# EAGLE design piezo-preamp-tickler_V0-7 (EAGLE 7.7.0)
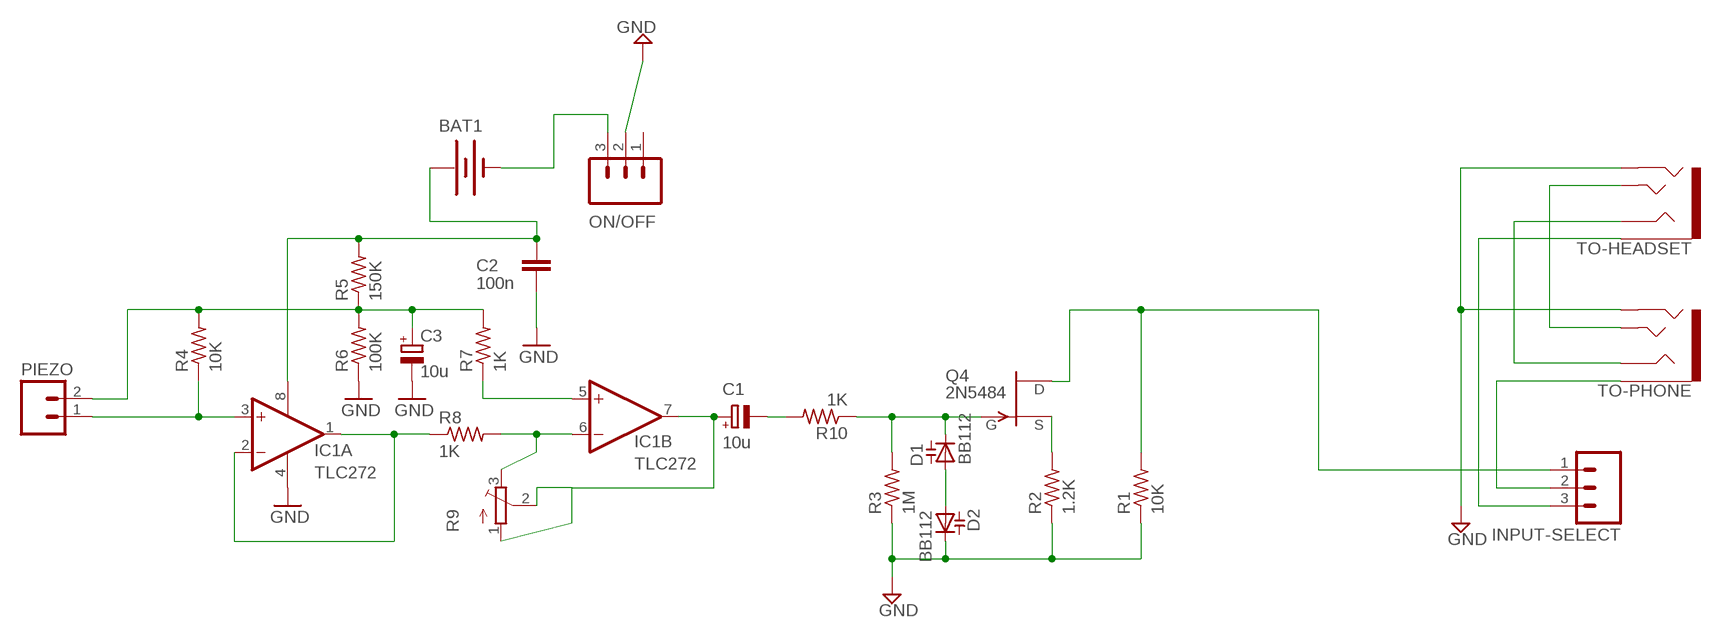
[diagram p0: schematic, sheet 1]

## Parts
BAT1  BATTERYA23  [BATTERY-A23]
C1  10u  CPOL-EUE2.5-5  [E2,5-5]
C2  100n  C-EU025-025X050  [C025-025X050]
C3  10u  CPOL-EUE2.5-5  [E2,5-5]
D1  BB112  [SOT54H]
D2  BB112  [SOT54H]
IC1  TLC272  TLC272P  [DIL08]
INPUT-SELECT  M03SINGLE-POLE-DOUBLE-THROW  [SPDT-SWITCH]
ON/OFF  labl  M03SINGLE-POLE-DOUBLE-THROW  [SPDT-SWITCH]
PIEZO  M02LOCK  [1X02_LOCK]
Q4  2N5484  [TO92-]
R1  10K  R-US_0204/2V  [0204V]
R2  1.2K  R-US_0204/2V  [0204V]
R3  1M  R-US_0204/2V  [0204V]
R4  10K  R-US_0204/2V  [0204V]
R5  150K  R-US_0204/2V  [0204V]
R6  100K  R-US_0204/2V  [0204V]
R7  1K  R-US_0204/2V  [0204V]
R8  1K  R-US_0204/2V  [0204V]
R9  TRIMPOT3386  [TRIM-3386]
R10  1K  R-US_0204/2V  [0204V]
TO-HEADSET  AUDIO-JACK3  [AUDIO-JACK-TRRS-SMD]
TO-PHONE  AUDIO-JACK3  [AUDIO-JACK-TRRS-SMD]

## Nets
`DEL: INPUT-SELECT.1 Q4.3(D) R1.2
GND: C2.1 C3.- D2.C IC1.4(P:V-) ON/OFF.2 R1.1 R2.1 R3.1 R6.1 TO-HEADSET.RING2 TO-PHONE.RING2
N$1: D1.A D2.A
N$2: BAT1.GND@1(-) ON/OFF.3
N$3: Q4.2(S) R2.2
N$5: IC1.5(B:+IN) R7.1
N$6: C1.+ IC1.7(B:OUT) R9.1(A) R9.2(S)
N$7: IC1.6(B:-IN) R8.2 R9.3(E)
N$8: C3.+ PIEZO.2 R4.2 R5.1 R6.2 R7.2
N$9: IC1.3(A:+IN) PIEZO.1 R4.1
N$10: D1.C Q4.1(G) R3.2 R10.1
N$11: C1.- R10.2
N$12: INPUT-SELECT.3 TO-HEADSET.EARTH
N$13: TO-HEADSET.TIP TO-PHONE.TIP
N$14: IC1.1(A:OUT) IC1.2(A:-IN) R8.1
N$15: TO-HEADSET.RING1 TO-PHONE.RING1
TO-PHONE: INPUT-SELECT.2 TO-PHONE.EARTH
V9V: BAT1.PWR@1(+) C2.2 IC1.8(P:V+) R5.2
Unconnected: ON/OFF.1

## Library data of the parts
BAT1 = Daniel:BATTERY: Battery Holders Various common sizes : AA, AAA, 18650 (PRT-12895), 20mm coin cell and 12mm coin cell. 20MM_4LEGS, BATT-10373
C1 C3 = rcl:CPOL-EU: POLARIZED CAPACITOR, European symbol
C2 = rcl:C-EU: CAPACITOR, European symbol
D1 D2 = diode:BB112: Capacity DIODE variable-capacitance diode
IC1 = linear:TLC272: OP AMP
INPUT-SELECT ON/OFF = Daniel:M03: Single Pole Double Throw Switch 2.0mm pitch 3-pin header for switch.
PIEZO = SparkFun-Connectors:M02: Header 2 Standard 2-pin 0.1" header. Use with straight break away headers (SKU : PRT-00116), right angle break away headers (PRT-00553), swiss pins (PRT-00743), machine pins (PRT-00117), and female headers (PRT-00115). Molex polarized connector foot print use with SKU : PRT-08233 with associated crimp pins and housings.
Q4 = transistor-fet:?548*: N-Channel JFETs Source: VISHAY 2N5484.pdf Compatible: TO92 2N5245 J304 J305 U310 J308 J309 J310 TO72 2N4416 2N4416A 2N3823 2N4351 3N169 3N170 3N171 MFE3002 TO18 2N3796 2N3797 MFE825 Source: Motorola European Master Guide Pacge 3-59
R1-R8 R10 = resistor:R-US_: RESISTOR, American symbol
R9 = adafruit:TRIMPOT: SMT trimmer potentiometer part number TC33X http://www.ladyada.net/library/eagle
TO-HEADSET TO-PHONE = SparkFun-Connectors:AUDIO-JACK3: Audio jack - 3.5mm TRRS variety - two rings.

## Net classes
0 default: width 0.152 mm, clearance 0.2 mm

## Board
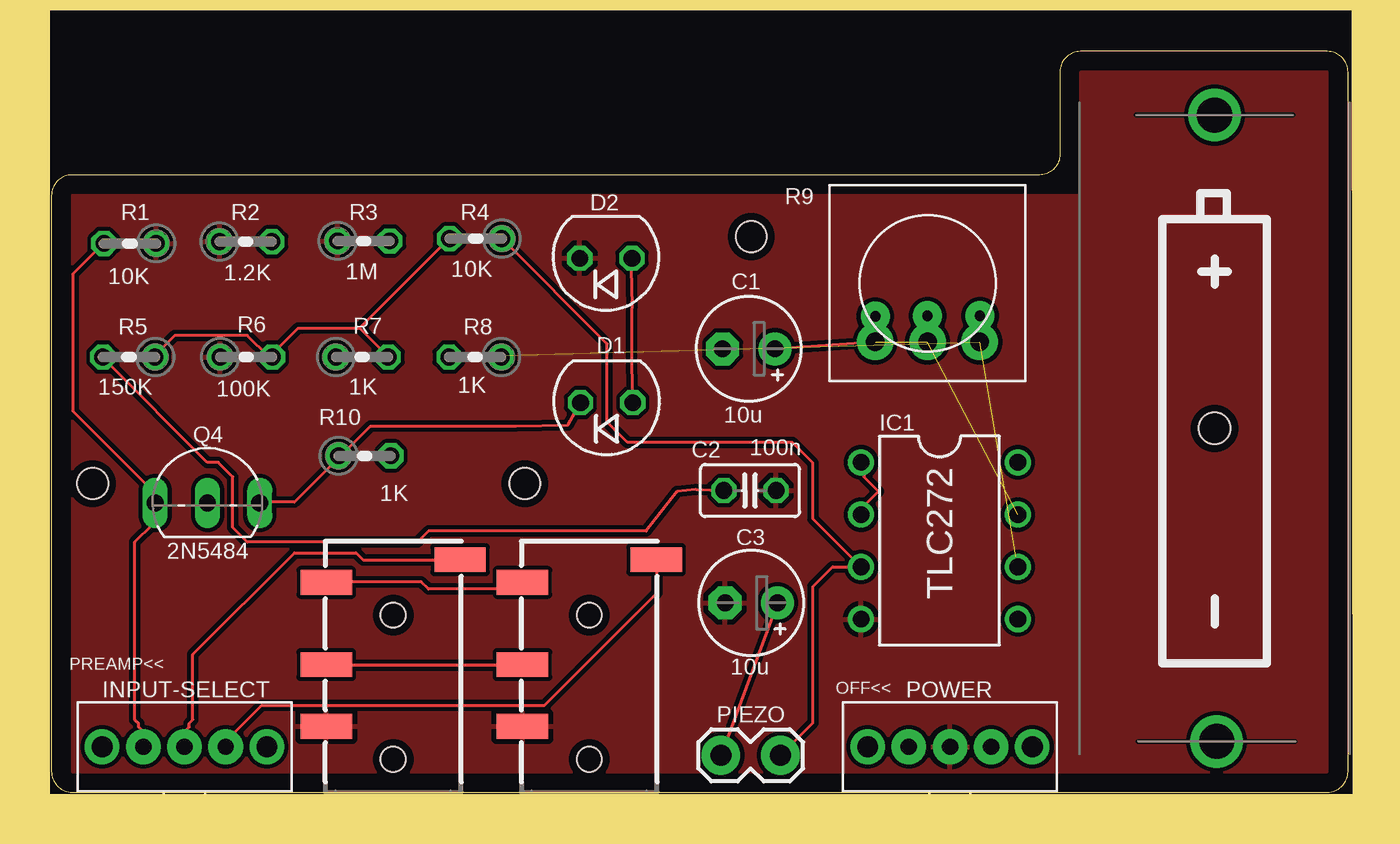
[diagram p1: board, top side]
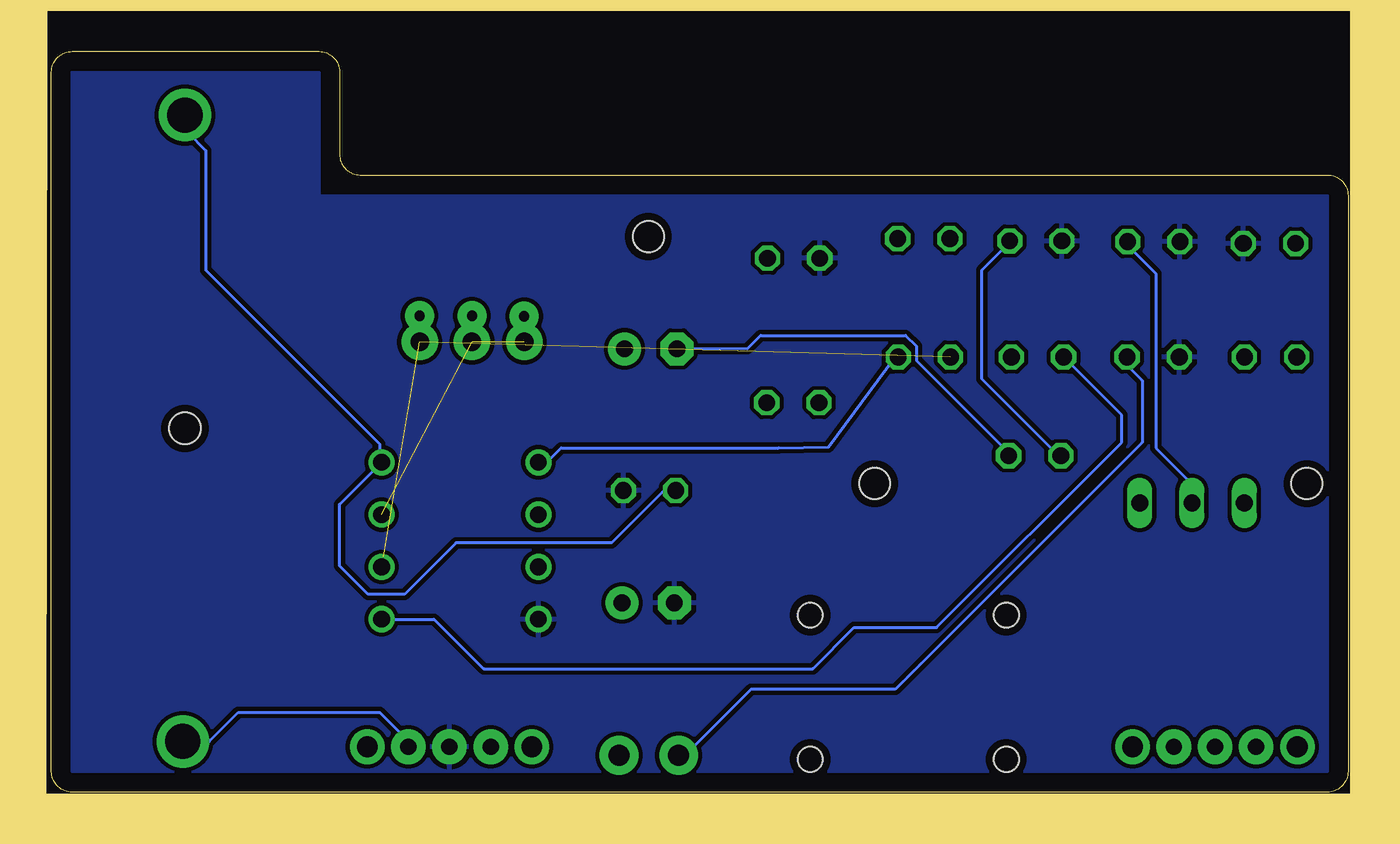
[diagram p2: board, bottom side, seen from below]

Size 63 x 36 mm. Coordinates in mm from the lower left corner, seen from the top.
Outline: 48,30 1,30 arc90 0,29 0,1 arc90 1,0 62,0 arc90 63,1 63,35 arc90 62,36 50,36 arc90 49,35 49,31 arc-90 48,30
Copper layers (1*16): Top 0.0356mm / dielectric 1.5011mm / Bottom 0.0356mm
Design rules "oshpark-2layer": minimum track width 6mil, minimum drill 13mil, track to track 6mil, track to pad 6mil, pad to pad 6mil, via to via 6mil, smd to smd 6mil, copper to edge 15mil, drill to drill 6mil, minimum pad ring 7mil, minimum via ring 7mil, stop-mask expansion 2.5mil, vias tented up to drill 0mil, thermal gap 10mil
Holes 1.5 mm at 34,27 2,15 23,15
Milling: 4 lines

### Footprints (pad centres in the part's own frame; a part is rotated, then mirrored left to right if it is on the bottom)
BATTERY-A23 = drill 1.702: GND@1 15.22,0.1; PWR@1 -15.22,0 | hole 1.524: 0,0
E2,5-5 = drill 0.813 pad 1.6: + -1.27,0 | drill 0.813 pad 1.6 octagon: - 1.27,0
C025-025X050 = drill 0.813 octagon: 1 -1.27,0; 2 1.27,0
SOT54H = drill 0.813 octagon: A 1.27,0; C -1.27,0
DIL08 = drill 0.813 pad 1.27: 1 -3.81,-3.81; 2 -1.27,-3.81; 3 1.27,-3.81; 4 3.81,-3.81; 5 3.81,3.81; 6 1.27,3.81; 7 -1.27,3.81; 8 -3.81,3.81
SPDT-SWITCH = drill 0.8 pad 1.676: 1 2,0; 2 4,0; 3 6,0 | drill 1 pad 1.676: P$1 0,0; P$2 8,0
1X02_LOCK = drill 1.016 pad 1.88: 1 -0.178,0; 2 2.718,0
TO92- = drill 0.813 long: 1 2.54,0; 2 0,0; 3 -2.54,0
0204V = drill 0.813 octagon: 1 -1.27,0; 2 1.27,0
TRIM-3386 = drill 0.9 pad 1.778: 1 -2.54,-2.857; 2 0,-2.857; 3 2.54,-2.857
AUDIO-JACK-TRRS-SMD = smd 1.2 x 2.5: EARTH 11.3,-3.25; RING1 6.2,3.25; RING2 3.2,3.25; TIP 10.2,3.25 | hole 1.2: 1.6,0; 8.6,0

### Placement (x,y rotation side)
BAT1  56.52,17.68 270 top
C1  33.88,21.55 180 top
C2  33.94,14.66 180 top
C3  34.01,9.2 180 top
D1  26.98,18.93 0 top
D2  26.94,25.95 0 top
IC1  43.15,12.22 270 top
INPUT-SELECT  2.46,2.21 0 top
ON/OFF  39.66,2.21 0 top
PIEZO  35.24,1.79 180 top
Q4  7.58,14.05 0 top
R1  3.81,26.67 180 top
R2  9.44,26.75 0 top
R3  15.17,26.79 0 top
R4  20.61,26.9 180 top
R5  3.77,21.15 180 top
R6  9.46,21.15 0 top
R7  15.09,21.15 0 top
R8  20.59,21.15 180 top
R9  42.56,24.74 0 top
R10  15.22,16.35 0 top
TO-HEADSET  26.13,0 90 top
TO-PHONE  16.61,0 90 top

### Tracks (layer width: path | path; a pad name or v marks a point on that pad's centre or on a via)
`DEL
  Top 0.152: INPUT-SELECT.1 4.41,2.29 4.41,3 4.23,3.17 4.23,3.35 4.05,3.52 4.05,12.16 4.93,13.04 4.93,13.92 Q4.3 4.93,14.1 4.93,14.62 1.06,18.5 1.06,25.2 2.47,26.61 R1.2
GND
  pour Bottom: 62,35 50,35 50,29 1,29 1,28 1,1 62,1
  pour Top: 62,1 62,35 50,35 50,29 1,29 1,1
N$1
  Top 0.152: D1.A 28.19,20.79 28.19,23.2 28.2,23.84 28.19,24.33 28.19,24.98 D2.A
N$2
  Bottom 0.152: ON/OFF.3 45.81,2.29 45.81,2.64 47.05,3.88 53.92,3.88 55.33,2.47 56.56,2.47 BAT1.GND@1
N$3
  Bottom 0.152: Q4.2 7.75,14.1 7.75,15.15 9.34,16.74 9.34,25.2 10.75,26.61 R2.2
N$5
  Bottom 0.152: IC1.5 44.41,8.41 42,6 26,6 24,8 20,8 11,17 11,18.33 R7.1
N$6  (2 unrouted)
  Top 0.152: R9.1 C1.+
N$7  (2 unrouted)
  Bottom 0.152: 46.87,11.45 46.87,11.1 IC1.6
N$8
  Top 0.152: R5.1 5.11,21.32 5.99,22.2 9.52,22.2 10.57,21.14 R6.2 10.75,21.32 11.98,22.55 14.98,22.55 | 14.98,22.55 16.21,21.32 R7.2 | 14.98,22.55 19.21,26.78 R4.2 | C3.+ PIEZO.2
  Bottom 0.152: R6.2 10.75,21.14 10.75,20.75 10,20 10,17 22,5 29,5 32,2 32.32,2 PIEZO.2
N$9
  Top 0.152: PIEZO.1 37,3.37 37,10 37.95,10.95 IC1.3 37,13.29 37,16 36,17 28,17 27,18 27,21.79 R4.1
N$10
  Top 0.152: Q4.1 10.22,14.1 11.8,14.1 13.92,16.21 R10.1 14.1,16.39 15.51,17.8 22.55,17.8 25.1,17.84 25.43,18.46 D1.C
  Bottom 0.152: R3.2 16.56,26.78 16.56,26.61 17.8,25.37 17.8,20.09 14.1,16.39 R10.1
N$11
  Bottom 0.152: R10.2 16.56,16.39 16.56,16.56 20.97,20.97 20.97,21.67 21.5,22.2 28.54,22.2 29.18,21.56 C1.-
N$12
  Top 0.152: TO-HEADSET.EARTH 29.43,11.28 29.43,9.69 23.96,4.23 10.22,4.23 8.63,2.64 8.63,2.29 INPUT-SELECT.3
N$13
  Top 0.152: TO-PHONE.TIP 13.39,10.22 17.97,10.22 18.32,9.87 22.55,9.87 22.73,10.04 TO-HEADSET.TIP
N$14
  Top 0.152: IC1.2 39.47,13.57 39.47,13.92 40.17,14.62 39.47,15.33 39.47,15.86 IC1.1
  Bottom 0.152: R8.1 22.02,21.14 25.25,16.77 27.66,16.74 38.23,16.74 38.94,16.03 39.29,16.03 IC1.1
N$15
  Top 0.152: TO-PHONE.RING1 13.39,6.17 22.73,6.17 TO-HEADSET.RING1
N$16  (via drill 0.5 pad 1.42)
  other vias: 40.03,23.13
N$17  (via drill 0.5 pad 1.42)
  other vias: 42.56,23.16
N$18  (via drill 0.5 pad 1.42)
  other vias: 45.12,23.16
TO-PHONE
  Top 0.152: TO-PHONE.EARTH 19.73,11.28 15.15,11.28 14.8,11.63 11.8,11.63 6.87,6.7 6.87,3.52 6.7,3.35 6.7,3.17 6.52,3 6.52,2.29 INPUT-SELECT.2
V9V
  Top 0.152: R5.2 2.64,21.14 2.64,20.97 7.58,16.03 8.11,16.03 8.81,15.33 8.81,12.86 9.52,12.16 17.8,12.16 18.32,12.69 28.89,12.69 30.4,14.61 31.31,14.71 C2.2
  Bottom 0.152: BAT1.PWR@1 56.38,32.77 56.38,32.07 55.5,31.19 55.5,25.37 47.05,16.91 47.05,16.03 IC1.8 49,13.99 49,11 47.62,9.62 45.84,9.62 43.34,12.12 35.77,12.12 33.24,14.66 C2.2

### Text on the board
tNames: PREAMP<< | OFF<< | POWER